# EAGLE design atmega328p_TH (EAGLE 7.2.0)
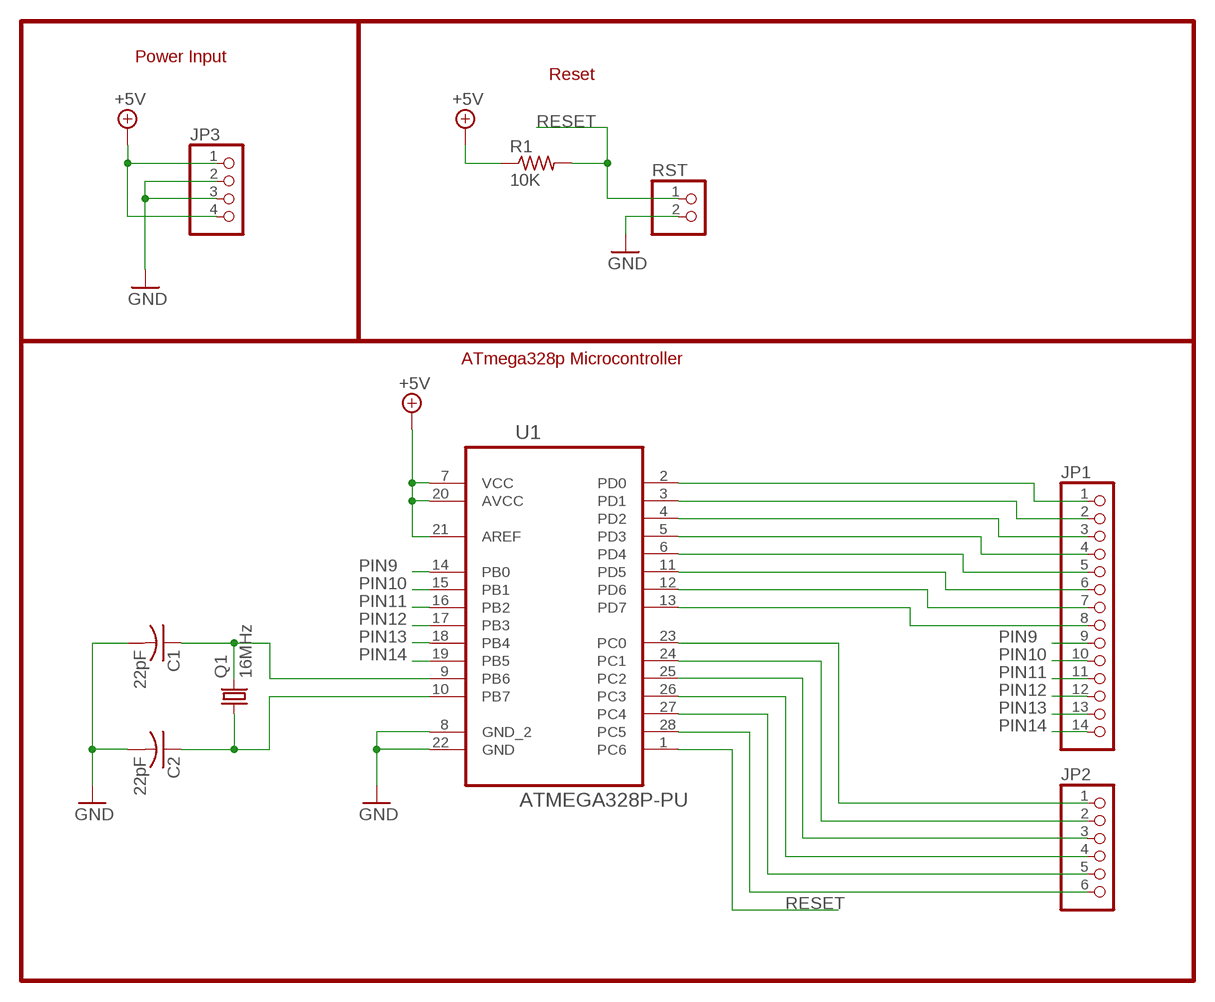
[diagram p0: schematic, sheet 1]

## Parts
C1  22pF  C-US025-024X044  [C025-024X044]
C2  22pF  C-US025-024X044  [C025-024X044]
JP1  PINHD-1X14  [1X14]
JP2  PINHD-1X6  [1X06]
JP3  PINHD-1X4  [1X04]
Q1  16MHz  CRYSTALHC49S  [HC49/S]
R1  10K  R-US_0204/7  [0204/7]
RST  PINHD-1X2  [1X02]
U1  ATMEGA328P-PU  [DIP254P762X457-28]

## Nets
+5V: JP3.1 JP3.4 R1.1 U1.7(VCC) U1.20(AVCC) U1.21(AREF)
GND: C1.2 C2.2 JP3.2 JP3.3 RST.2 U1.8(GND_2) U1.22(GND)
N$2: C1.1 Q1.2 U1.9(PB6)
N$3: C2.1 Q1.1 U1.10(PB7)
N$5: JP1.1 U1.2(PD0)
N$6: JP1.2 U1.3(PD1)
N$7: JP1.3 U1.4(PD2)
N$8: JP1.4 U1.5(PD3)
N$9: JP1.5 U1.6(PD4)
N$10: JP1.6 U1.11(PD5)
N$11: JP1.7 U1.12(PD6)
N$12: JP1.8 U1.13(PD7)
N$19: JP2.1 U1.23(PC0)
N$20: JP2.2 U1.24(PC1)
N$21: JP2.3 U1.25(PC2)
N$22: JP2.4 U1.26(PC3)
N$23: JP2.5 U1.27(PC4)
N$24: JP2.6 U1.28(PC5)
PIN9: JP1.9 U1.14(PB0)
PIN10: JP1.10 U1.15(PB1)
PIN11: JP1.11 U1.16(PB2)
PIN12: JP1.12 U1.17(PB3)
PIN13: JP1.13 U1.18(PB4)
PIN14: JP1.14 U1.19(PB5)
RESET: R1.2 RST.1 U1.1(PC6)

## Notes on the sheet
- Power Input
- Reset
- ATmega328p Microcontroller

## Library data of the parts
C1 C2 = resistor:C-US: CAPACITOR, American symbol
JP1 = pinhead:PINHD-1X14: PIN HEADER
JP2 = pinhead:PINHD-1X6: PIN HEADER
JP3 = pinhead:PINHD-1X4: PIN HEADER
Q1 = adafruit:CRYSTAL: CRYSTAL; OC_FARNELL: 1667008; OC_NEWARK: unknown
R1 = resistor:R-US_: RESISTOR, American symbol
RST = pinhead:PINHD-1X2: PIN HEADER
U1 = Atmel_By_element14_Batch_1-00:ATMEGA328P-PU: 8-bit Microcontroller with In-System Programmable Flash; MPN: ATMEGA328P-PU; OC_FARNELL: 1715487; OC_NEWARK: 15R0268; PACKAGE: PDIP-28; SUPPLIER: Atmel

## Board
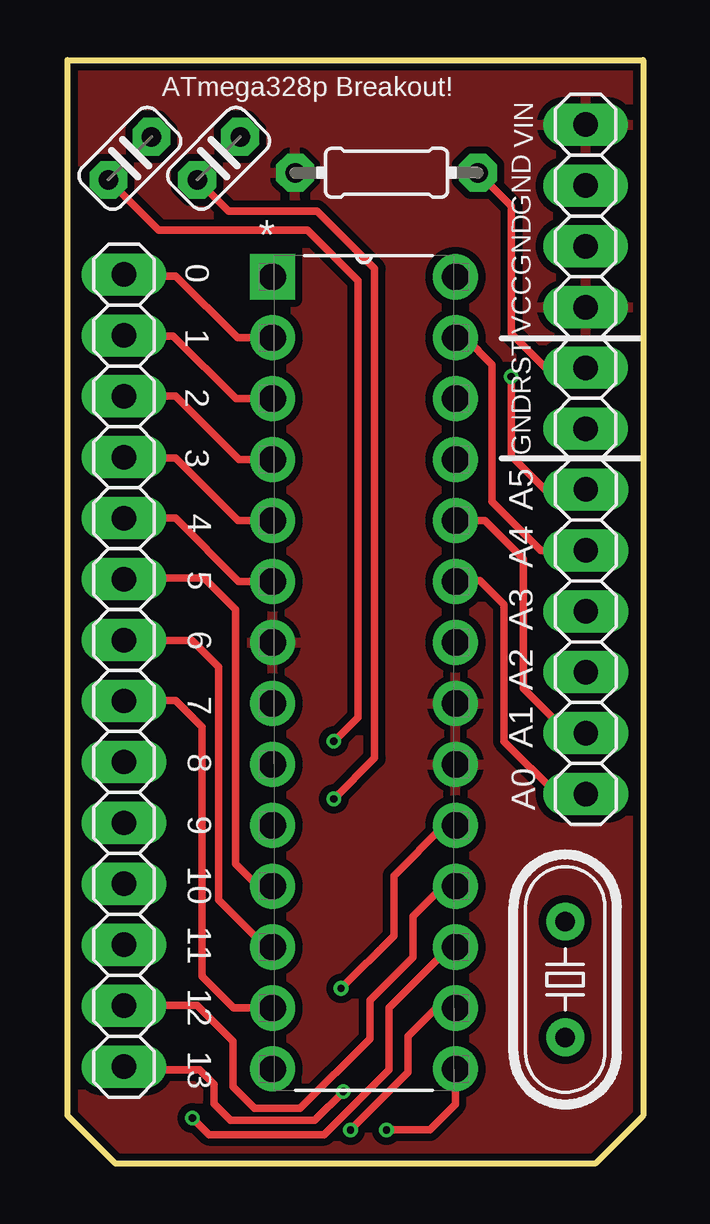
[diagram p1: board, top side]
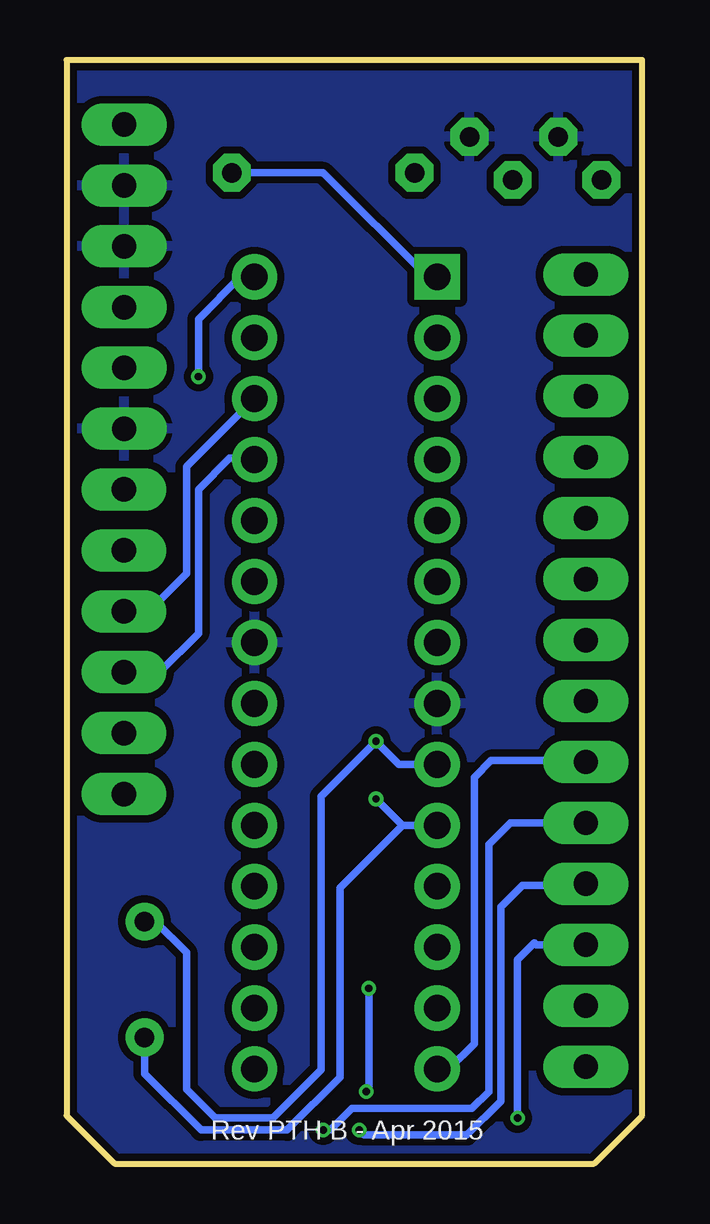
[diagram p2: board, bottom side, seen from below]

Size 24 x 46 mm. Coordinates in mm from the lower left corner, seen from the top.
Outline: 0,46 24,46 24,2 22,0 2,0 0,2 0,46
Copper layers (1*16): Top 0.035mm / dielectric 1.5mm / Bottom 0.035mm
Design rules "dirt_cheap_dirty_boards.v1 *": minimum track width 5mil, minimum drill 12mil, track to track 5mil, track to pad 5mil, pad to pad 5mil, via to via 5mil, smd to smd 0mil, copper to edge 10mil, drill to drill 10mil, minimum pad ring 15mil, minimum via ring 6mil, stop-mask expansion 2mil, vias tented up to drill 25mil, thermal gap 10mil

### Footprints (pad centres in the part's own frame; a part is rotated, then mirrored left to right if it is on the bottom)
C025-024X044 = drill 0.813 octagon: 1 -1.27,0; 2 1.27,0
1X14 = drill 1.016 long: 1 -16.51,0; 2 -13.97,0; 3 -11.43,0; 4 -8.89,0; 5 -6.35,0; 6 -3.81,0; 7 -1.27,0; 8 1.27,0; 9 3.81,0; 10 6.35,0; 11 8.89,0; 12 11.43,0; 13 13.97,0; 14 16.51,0
1X06 = drill 1.016 long: 1 -6.35,0; 2 -3.81,0; 3 -1.27,0; 4 1.27,0; 5 3.81,0; 6 6.35,0
1X04 = drill 1.016 long: 1 -3.81,0; 2 -1.27,0; 3 1.27,0; 4 3.81,0
HC49/S = drill 0.813: 1 -2.413,0; 2 2.413,0
0204/7 = drill 0.813 octagon: 1 -3.81,0; 2 3.81,0
1X02 = drill 1.016 long: 1 -1.27,0; 2 1.27,0
DIP254P762X457-28 = drill 1.118 square: 1 -7.62,33.02 | drill 1.118: 2 -7.62,30.48; 3 -7.62,27.94; 4 -7.62,25.4; 5 -7.62,22.86; 6 -7.62,20.32; 7 -7.62,17.78; 8 -7.62,15.24; 9 -7.62,12.7; 10 -7.62,10.16; 11 -7.62,7.62; 12 -7.62,5.08; 13 -7.62,2.54; 14 -7.62,0; 15 0,0; 16 0,2.54; 17 0,5.08; 18 0,7.62; 19 0,10.16; 20 0,12.7; 21 0,15.24; 22 0,17.78; 23 0,20.32; 24 0,22.86; 25 0,25.4; 26 0,27.94; 27 0,30.48; 28 0,33.02

### Placement (x,y rotation side)
C1  2.6,41.9 45 top
C2  6.3,41.9 45 top
JP1  2.35,20.55 270 top
JP2  21.61,21.75 90 top
JP3  21.6,39.5 90 top
Q1  20.75,7.67 90 top
R1  13.3,41.3 0 top
RST  21.6,31.9 270 top
U1  16.17,3.94 0 top

### Tracks (layer width: path | path; a pad name or v marks a point on that pad's centre or on a via)
+5V
  pour Top (isolate 0.305): 0,46 24,46 24,0 0,0
GND
  pour Bottom (isolate 0.305): 0,46 24,46 24,0 0,0
N$2  (via drill 0.3)
  Top 0.305: C1.1 3.8,38.9 10,38.9 12.1,36.8 12.1,18.6 v11.1,17.6
  Bottom 0.305: U1.9 10.14,16.64 v11.1,17.6 13.4,15.3 13.4,3.9 15.4,1.9 17.8,1.9 19,3.1 19,8.8 20.28,10.08 Q1.2
N$3  (via drill 0.3)
  Top 0.305: C2.1 6.7,39.7 10.4,39.7 12.8,37.3 12.8,16.9 v11.1,15.2
  Bottom 0.305: U1.10 10,14.1 | 10,14.1 12.6,11.5 12.6,3.6 14.8,1.4 18.4,1.4 20.75,3.75 Q1.1 | 10,14.1 v11.1,15.2
N$5
  Top 0.305: JP1.1 2.71,37 4.5,37 7.08,34.42 U1.2
N$6
  Top 0.305: JP1.2 2.67,34.5 4.4,34.5 7.02,31.88 U1.3
N$7
  Top 0.305: JP1.3 2.67,32 4.5,32 7.16,29.34 U1.4
N$8
  Top 0.305: JP1.4 2.69,29.4 4.5,29.4 7.1,26.8 U1.5
N$9
  Top 0.305: JP1.5 4.5,26.9 7.14,24.26 U1.6
N$10
  Top 0.305: JP1.6 2.69,24.4 5.7,24.4 7,23.1 7,12.5 7.94,11.56 U1.11
N$11
  Top 0.305: JP1.7 2.67,21.8 5.2,21.8 6.3,20.7 6.3,11 8.28,9.02 U1.12
N$12
  Top 0.305: JP1.8 2.67,19.3 4.5,19.3 5.6,18.2 5.6,7.8 6.92,6.48 U1.13
N$19
  Top 0.305: U1.23 16.21,24.3 17.2,24.3 18.2,23.3 18.2,17.6 20.4,15.4 JP2.1
N$20
  Top 0.305: U1.24 17.4,26.8 19,25.2 19,19.8 20.86,17.94 JP2.2
N$21
  Bottom 0.305: U1.25 16.23,29.4 17.2,29.4 18.5,28.1 18.5,22.1 20.12,20.48 JP2.3
N$22
  Bottom 0.305: JP2.4 20.58,23.02 19,24.6 19,29.05 U1.26
N$23
  Top 0.305: U1.27 16.19,34.4 16.6,34.4 17.7,33.3 17.7,27.6 19.74,25.56 JP2.5
N$24  (via drill 0.3)
  Top 0.305: JP2.6 19.9,28.1 18.5,29.5 v18.5,32.8
  Bottom 0.305: v18.5,32.8 18.5,35.2 16.74,36.96 U1.28
PIN9
  Bottom 0.305: JP1.9 2.71,16.8 6.3,16.8 7,16.1 7,5 8.06,3.94 U1.14
PIN10  (via drill 0.3)
  Top 0.305: v13.3,1.4 15.1,1.4 16.17,2.47 U1.15
  Bottom 0.305: JP1.10 5.5,14.2 6.4,13.3 6.4,3 7.1,2.3 12.1,2.3 13,1.4 v13.3,1.4
PIN11  (via drill 0.3)
  Top 0.305: v11.8,1.4 14.2,3.8 14.2,5.3 15.38,6.48 U1.16
  Bottom 0.305: JP1.11 2.71,11.6 5,11.6 5.9,10.7 5.9,2.6 7.3,1.2 11.6,1.2 v11.8,1.4
PIN12  (via drill 0.3)
  Top 0.305: v5.2,1.9 5.9,1.2 10.7,1.2 13.4,3.9 13.4,6.5 15.92,9.02 U1.17
  Bottom 0.305: JP1.12 4.42,9.12 4.5,9.2 5.2,8.5 v5.2,1.9
PIN13
  Top 0.305: JP1.13 2.67,6.6 5.4,6.6 6.9,5.1 6.9,3.2 7.8,2.3 9.7,2.3 12.6,5.2 12.6,6.8 14.4,8.6 14.4,10.3 15.66,11.56 U1.18
PIN14  (via drill 0.3)
  Top 0.305: JP1.14 2.79,3.9 5.5,3.9 6.1,3.3 6.1,2.5 6.8,1.8 10.3,1.8 v11.5,3 | v11.4,7.3 13.6,9.5 13.6,12 15.7,14.1 U1.19
  Bottom 0.305: v11.5,3 11.4,3.1 v11.4,7.3
RESET
  Top 0.305: RST.1 19.93,33.17 18.5,34.6 18.5,39.91 R1.2
  Bottom 0.305: U1.1 8.96,36.96 13.3,41.3 R1.2

### Text on the board
tPlace: ATmega328p Breakout! | VIN | GND | GND | 0 | VCC | 1 | RST | 2 | GND | 3 | A5 | 4 | A4 | 5 | A3 | 6 | A2 | 7 | A1 | 8 | A0 | 9 | 10 | 11 | 12 | 13
bPlace: Rev PTH B - Apr 2015